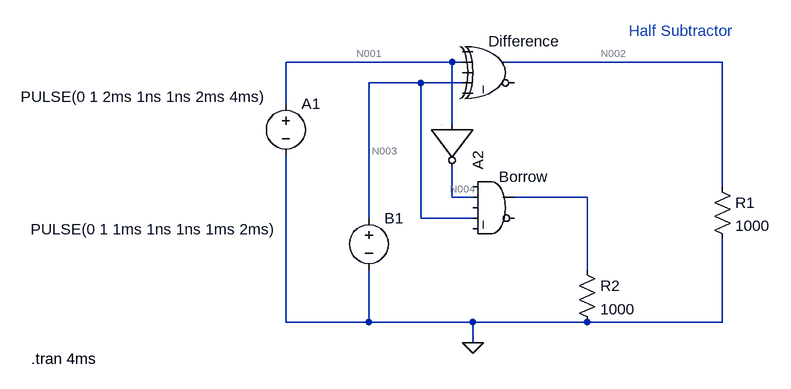
[diagram p0: schematic HALF_SUBTRACTOR_GOKUL.asc]
HALF_SUBTRACTOR_GOKUL.asc, the LTspice schematic file:
Version 4
SHEET 1 964 680
WIRE 464 -32 208 -32
WIRE 480 -32 464 -32
WIRE 880 -32 544 -32
WIRE 416 0 336 0
WIRE 480 0 416 0
WIRE 208 32 208 -32
WIRE 464 64 464 -32
WIRE 880 160 880 -32
WIRE 464 176 464 128
WIRE 496 176 464 176
WIRE 672 176 560 176
WIRE 336 208 336 0
WIRE 416 208 416 0
WIRE 496 208 416 208
WIRE 672 288 672 176
WIRE 208 368 208 112
WIRE 336 368 336 288
WIRE 336 368 208 368
WIRE 496 368 336 368
WIRE 672 368 496 368
WIRE 880 368 880 240
WIRE 880 368 672 368
WIRE 496 400 496 368
FLAG 496 400 0
SYMBOL res 864 144 R0
SYMATTR InstName R1
SYMATTR Value 1000
SYMBOL res 656 272 R0
SYMATTR InstName R2
SYMATTR Value 1000
SYMBOL Digital\\xor 528 -80 R0
SYMATTR InstName Difference
SYMBOL voltage 208 16 R0
WINDOW 3 -408 5 Left 2
WINDOW 123 0 0 Left 0
WINDOW 39 0 0 Left 0
SYMATTR Value PULSE(0 1 2ms 1ns 1ns 2ms 4ms)
SYMATTR InstName A1
SYMBOL voltage 336 192 R0
WINDOW 3 -521 33 Left 2
WINDOW 123 0 0 Left 0
WINDOW 39 0 0 Left 0
SYMATTR Value PULSE(0 1 1ms 1ns 1ns 1ms 2ms)
SYMATTR InstName B1
SYMBOL Digital\\inv 528 64 R90
SYMATTR InstName A2
SYMBOL Digital\\and 528 128 R0
SYMATTR InstName Borrow
TEXT -184 424 Left 2 !.tran 4ms
TEXT 736 -80 Left 2 ;Half Subtractor

The netlist it stands for:
* HALF_SUBTRACTOR_GOKUL.asc
R1 N002 0 1000
R2 N005 0 1000
A§Difference 0 N001 0 N003 0 0 N002 0 XOR
V§A1 N001 0 PULSE(0 1 2ms 1ns 1ns 2ms 4ms)
V§B1 N003 0 PULSE(0 1 1ms 1ns 1ns 1ms 2ms)
A2 N001 0 0 0 0 N004 0 0 BUF
A§Borrow 0 N004 0 N003 0 0 N005 0 AND
.tran 4ms
* Half Subtractor
.backanno
.end

* Results of the author's LTspice run, read from the files saved beside the schematic
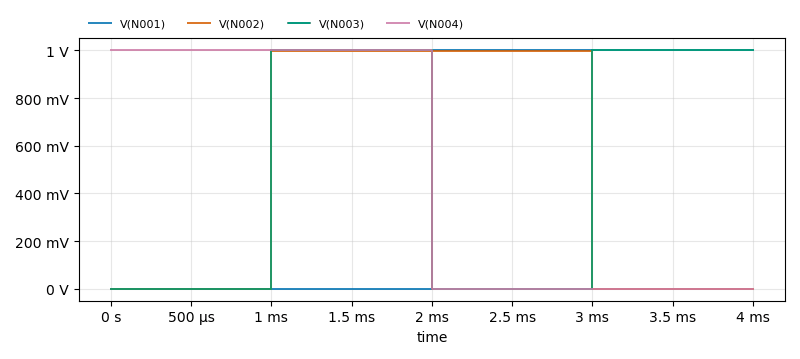
[diagram p1: Transient Analysis of HALF_SUBTRACTOR_GOKUL.asc, plotted from the saved traces]
* Transient Analysis, 1 run:
*   V(N001): min 0 V, max 1 V, average 500 mV, rms 707.1 mV, last 1 V
*   V(N002): min 0 V, max 999 mV, average 499.5 mV, rms 706.4 mV, last 0 V
*   V(N003): min 0 V, max 1 V, average 500 mV, rms 707.1 mV, last 1 V
*   V(N004): min 0 V, max 1 V, average 500 mV, rms 707.1 mV, last 0 V